# Altium schematic sheet Scheme.SchDoc: Proxxon_PWM_Board
size A4; Author: Maxim4ik163; DrawnBy: Maxim4ik163
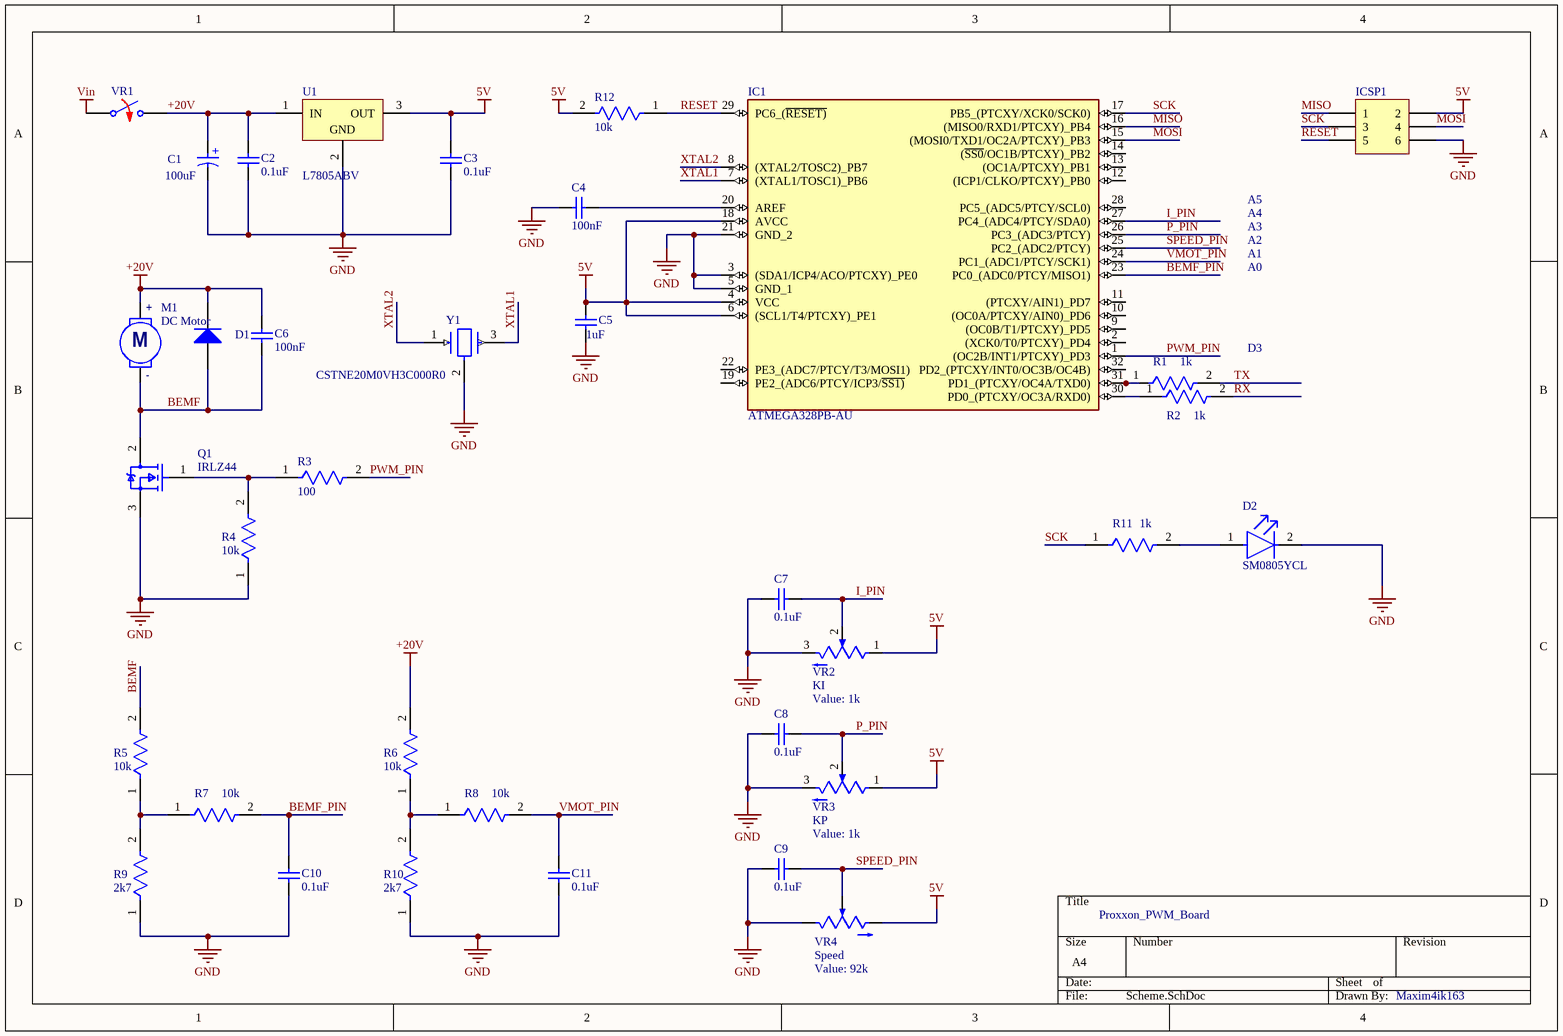
[diagram p0: Scheme.SchDoc]

## Parts
C1  100uF  [WCAP-ATLL_D8H11.5]
C2  0.1uF  [CAPC1608X92X38ML15T08]
C3  0.1uF  [CAPC1608X92X38ML15T08]
C4  100nF  [CAPC1608X92X38ML15T08]
C5  1uF  [CAPC1608X92X38ML15T08]
C6  100nF  [CAPC1608X92X38ML15T08]
C7  0.1uF  [CAPC1608X92X38ML15T08]
C8  0.1uF  [CAPC1608X92X38ML15T08]
C9  0.1uF  [CAPC1608X92X38ML15T08]
C10  0.1uF  [CAPC1608X92X38ML15T08]
C11  0.1uF  [CAPC1608X92X38ML15T08]
D1  Diode 1N4006  [DIO10.46-5.3x2.8]  (value not drawn)
D2  SM0805YCL  [FP-SM0805YCL-MFG]
IC1  ATMEGA328PB-AU  [QFP80P900X900X120-32N]
ICSP1  (no value)  [PBS3x2]
M1  DC Motor  [placeholder]
Q1  IRLZ44  [FP-PG-TO220-3-MFG]
R1  1k  [FP-MCT0603-MFG]
R2  1k  [FP-MCT0603-MFG]
R3  100  [FP-MCT0603-MFG]
R4  10k  [FP-MCT0603-MFG]
R5  10k  [FP-MCT0603-MFG]
R6  10k  [FP-MCT0603-MFG]
R7  10k  [FP-MCT0603-MFG]
R8  10k  [FP-MCT0603-MFG]
R9  2k7  [FP-MCT0603-MFG]
R10  2k7  [FP-MCT0603-MFG]
R11  1k  [FP-MCT0603-MFG]
R12  10k  [FP-MCT0603-MFG]
U1  L7805ABV  [TO220]
VR1  Switch Normally Opened  [placeholder]  (value not drawn)
VR2  KI  value 1k  [TRIM_3362W-1-203LF]
VR3  KP  value 1k  [TRIM_3362W-1-203LF]
VR4  Speed  value 92k  [Res-var - COMPACT]
Y1  CSTNE20M0VH3C000R0  [FP-CSTNE20M0VH3C000R0-MFG]

## Nets
5V: C3.2 C5.2 IC1.4(VCC) IC1.6((SCL1/T4/PTCXY)_PE1) IC1.18(AVCC) ICSP1.2 R12.2 U1.3(OUT) VR2.1(CCW) VR3.1(CCW) VR4.3(CW)
+20V: C1.1(P) C2.2 C6.2 D1.2(K) M1.1(+) R6.2 U1.1(IN) VR1.2
GND: C1.2(N) C2.1 C3.1 C4.2 C5.1 C7.1 C8.1 C9.1 C10.1 C11.1 D2.2(C) IC1.3((SDA1/ICP4/ACO/PTCXY)_PE0) IC1.5(GND_1) IC1.21(GND_2) ICSP1.6 Q1.3(S) R4.1 R9.1 R10.1 U1.2(GND) VR2.3(CW) VR3.3(CW) VR4.1(CCW) Y1.2(GND)
Vin: VR1.1
BEMF: C6.1 D1.1(A) M1.2(-) Q1.2(D) R5.2
BEMF_PIN: C10.2 IC1.23(PC0_(ADC0/PTCY/MISO1)) R7.2
I_PIN: C7.2 IC1.27(PC4_(ADC4/PTCY/SDA0)) VR2.2(WIPER)
MISO: IC1.16((MISO0/RXD1/PTCXY)_PB4) ICSP1.1
MOSI: IC1.15((MOSI0/TXD1/OC2A/PTCXY)_PB3) ICSP1.4
P_PIN: C8.2 IC1.26(PC3_(ADC3/PTCY)) VR3.2(WIPER)
PWM_PIN: IC1.1((OC2B/INT1/PTCXY)_PD3) R3.2
RESET: IC1.29(PC6_(~{RESET)}) ICSP1.5 R12.1
RX: R2.2
SCK: IC1.17(PB5_(PTCXY/XCK0/SCK0)) ICSP1.3 R11.1
SPEED_PIN: C9.2 IC1.25(PC2_(ADC2/PTCY)) VR4.2(WIPER)
TX: R1.2
VMOT_PIN: C11.2 IC1.24(PC1_(ADC1/PTCY/SCK1)) R8.2
XTAL1: IC1.7((XTAL1/TOSC1)_PB6) Y1.3(Output)
XTAL2: IC1.8((XTAL2/TOSC2)_PB7) Y1.1(Input)
NetC4_1: C4.1 IC1.20(AREF)
NetD2_1: D2.1(A) R11.2
NetIC1_30: IC1.30(PD0_(PTCXY/OC3A/RXD0)) R2.1
NetIC1_31: IC1.31(PD1_(PTCXY/OC4A/TXD0)) R1.1
NetQ1_1: Q1.1(G) R3.1 R4.2
NetR5_1: R5.1 R7.1 R9.2
NetR6_1: R6.1 R8.1 R10.2

Not connected (* = marked no-connect by the designer): IC1 2((XCK0/T0/PTCXY)_PD4) 9((OC0B/T1/PTCXY)_PD5) 10((OC0A/PTCXY/AIN0)_PD6) 11((PTCXY/AIN1)_PD7) 12((ICP1/CLKO/PTCXY)_PB0) 13((OC1A/PTCXY)_PB1) 14((~{SS0}/OC1B/PTCXY)_PB2) 19(PE2_(ADC6/PTCY/ICP3/~{SS1)}) 22(PE3_(ADC7/PTCY/T3/MOSI1)) 28(PC5_(ADC5/PTCY/SCL0)) 32(PD2_(PTCXY/INT0/OC3B/OC4B))

## Notes on the sheet
- A2
- A3
- A4
- A5
- A0
- A1
- D3
- (in symbol CMP-03913-54007388-2) +
- (in symbol DC Motor) M

## Library data of the parts
C1 = CMP-03913-54007388-2: Aluminium Electrolytic Capacitor-Leaded Rohs Compliant: Yes; Leakage Current: 27µA; Polarity: Polar; Voltage Rating: 10V; Ripple Current: 420mA; Pitch: 3.5mm; Impedance: 530mΩ; Life (Hours): 7000hours; Capacitance: 270µF; Tolerance: 20%; Mount: Through Hole; Max Operating Temperature: 105°C; Length: 11.5mm; Lead Pitch: 3.5052mm; Min Operating Temperature: -55°C; Height - Seated (Max): 13.0048mm; Case/Package: Radial; Diameter: 8mm; Packaging: Tape & Box (TB); RoHS: Compliant
C2-C11 = CMP-2006-01142-1: Manufacturer: Vitramon; Part Number: VJ0603Y102KXXAC
D1 = Diode 1N4006: 1 Amp General Purpose Rectifier; Published: 8-Jun-2000; LatestRevisionDate: 17-Jul-2002; LatestRevisionNote: Re-released for DXP Platform.; DatasheetVersion: 1998; PackageVersion: Aug-1999; PackageReference: DO-41; Publisher: Altium Limited; Code_JEDEC: DO-204-AL; ComponentLink1Description: Manufacturer Link; ComponentLink1URL: http://www.fairchildsemi.com/; ComponentLink2Description: Datasheet; ComponentLink2URL: http://www.fairchildsemi.com/ds/1N%2F1N4001.pdf
D2 = CMP-35283-000007-1: LED YELLOW CLEAR 0805 SMD; Luminous Intensity: 11.5mcd; Test Current: 2mA; Viewing Angle: 130°; Dominant Wavelength: 592nm; Forward Voltage: 1.9V; Lens Color: Colorless; Case Code (Metric): 2012; Illumination Color: Yellow; Length: 2mm; Max Operating Temperature: 80°C; Width: 1.2mm; Case Code (Imperial): 0805; Packaging: Tape and Reel; Lens Transparency: Clear; Mount: Surface Mount; Case/Package: 0805; Forward Current: 2mA; Height: 0.8mm; Lead Free: Lead Free; Min Operating Temperature: -30°C; Color: Yellow; Package Quantity: 4000
IC1 = ATMEGA328PB-AU: AVR AVRВ® ATmega, Functional Safety (FuSa) Microcontroller IC 8-Bit 20MHz 32KB (16K x 16) FLASH 32-TQFP (7x7); MF: Microchip Technology; MP: ATMEGA328PBAU; SnapEDA_Link: https://www.snapeda.com/parts/ATMEGA328PBAU/Microchip+Technology/view-part/?ref=snap; Package: None; Value: *; Check_prices: https://www.snapeda.com/parts/ATMEGA328PBAU/Microchip+Technology/view-part/?ref=eda
ICSP1 = Header 3X2A: Header, 3-Pin, Dual row; LatestRevisionDate: 17-Jul-2002; LatestRevisionNote: Re-released for DXP Platform.; Publisher: Altium Limited
M1 = DC Motor: LA: 1.5M; RA: 0.5; KE: 0.05; JM: 250U; BM: 0.1M; TL: 0; SimulationGenericComponent: True; KT: 0.05
Q1 = CMP-32901-000488-1: MOSFET N-CH 55V 47A TO220AB; Turn-On Delay Time: 11ns; Gate to Source Voltage (Vgs): 16V; Element Configuration: Single; Rds On Max: 22mR; Turn-Off Delay Time: 26ns; Max Power Dissipation: 110W; Threshold Voltage: 2V; Drain to Source Resistance: 35mR; Input Capacitance: 1.7nF; Continuous Drain Current (ID): 47A; Case/Package: TO-220; Lead Free: Lead Free; Halogen Free: Halogen Free; Packaging: Rail/Tube; Length: 0.414inch; Min Operating Temperature: -55°C; REACH SVHC: No SVHC; Number of Pins: 3; Width: 0.185inch; Drain to Source Voltage (Vdss): 55V; Power Dissipation: 110W; RoHS Compliant: Yes; Max Operating Temperature: 175°C; Height: 0.6inch; Max Dual Supply Voltage: 55V; Drain to Source Breakdown Voltage: 55V; Mount: Through Hole
R1-R12 = CMP-02407-000603-1: RES SMD 100 OHM 1% 1/8W 0603; Resistance: 4.02kR; Voltage Rating: 75V; Tolerance: 0.1%; Power Rating: 125mW; Packaging: Tape and Reel; Width: 0.85mm; Length: 1.55mm; Composition: Thin Film; Max Operating Temperature: 155°C; Min Operating Temperature: -55°C; Case/Package: 0603; Case Code (Metric): 1608; Case Code (Imperial): 0603; Height: 0.45mm; Weight: 6.7E-05oz
U1 = CMP-0244-00485-1: Positive Voltage Regulator, 5V, 3-Pin TO-220; ComponentLink1URL: http://www.st.com; PackageDescription: TO, Thru-Hole, Vertical, Heatsink Mounted; 3 In-Line Leads; Pitch 2.54 mm; DatasheetVersion: 16/11/2011; ComponentLink2Description: Datasheet; ComponentLink1Description: Manufacturer URL; PackageReference: TO220; ComponentLink3Description: Package Specification; ComponentLink2URL: http://www.st.com/internet/com/TECHNICAL_RESOURCES/TECHNICAL_LITERATURE/DATASHEET/CD00000444.pdf; ComponentLink3URL: http://www.st.com/internet/com/TECHNICAL_RESOURCES/TECHNICAL_LITERATURE/PACKAGE_INFORMATION/CD00004649.pdf; PackageVersion: ver3.0
VR1 = SW NO: closed: 0; Rclosed: 1m; Ropen: 1Meg; SimulationGenericComponent: True
VR2 VR3 = 3362W-1-203LF: 1/4 Sq, Thru-Hole, TRIMMER, 20 Kilohms, Cermet, Single Turn | Bourns 3362W-1-203LF; SnapEDA_Link: https://www.snapeda.com/parts/3362W-1-203LF/Bourns/view-part/?ref=snap; Package: DIP-3 Bourns; MF: Bourns; MP: 3362W-1-203LF; Check_prices: https://www.snapeda.com/parts/3362W-1-203LF/Bourns/view-part/?ref=eda
VR4 = Res-var: 1/4 Sq, Thru-Hole, TRIMMER, 20 Kilohms, Cermet, Single Turn | Bourns 3362W-1-203LF; SnapEDA_Link: https://www.snapeda.com/parts/3362W-1-203LF/Bourns/view-part/?ref=snap; Package: DIP-3 Bourns; MF: Bourns; MP: 3362W-1-203LF; Check_prices: https://www.snapeda.com/parts/3362W-1-203LF/Bourns/view-part/?ref=eda
Y1 = CMP-06057-000018-1: CERAMIC RES 20.0000MHZ 15PF SMD; Frequency Stability: 0.13%; Frequency Tolerance: 0.07%; Frequency: 20MHz; Impedance: 40R; RoHS Compliant: Yes; Packaging: Cut Tape; Mount: Surface Mount; Case/Package: SMD/SMT; Max Operating Temperature: 125°C; Capacitance: 15pF; Min Operating Temperature: -40°C; Resistor Type: Ceramic